# Altium schematic sheet top.SchDoc
size 420 x 297 mm; SheetNumber: 1; SheetTotal: 6
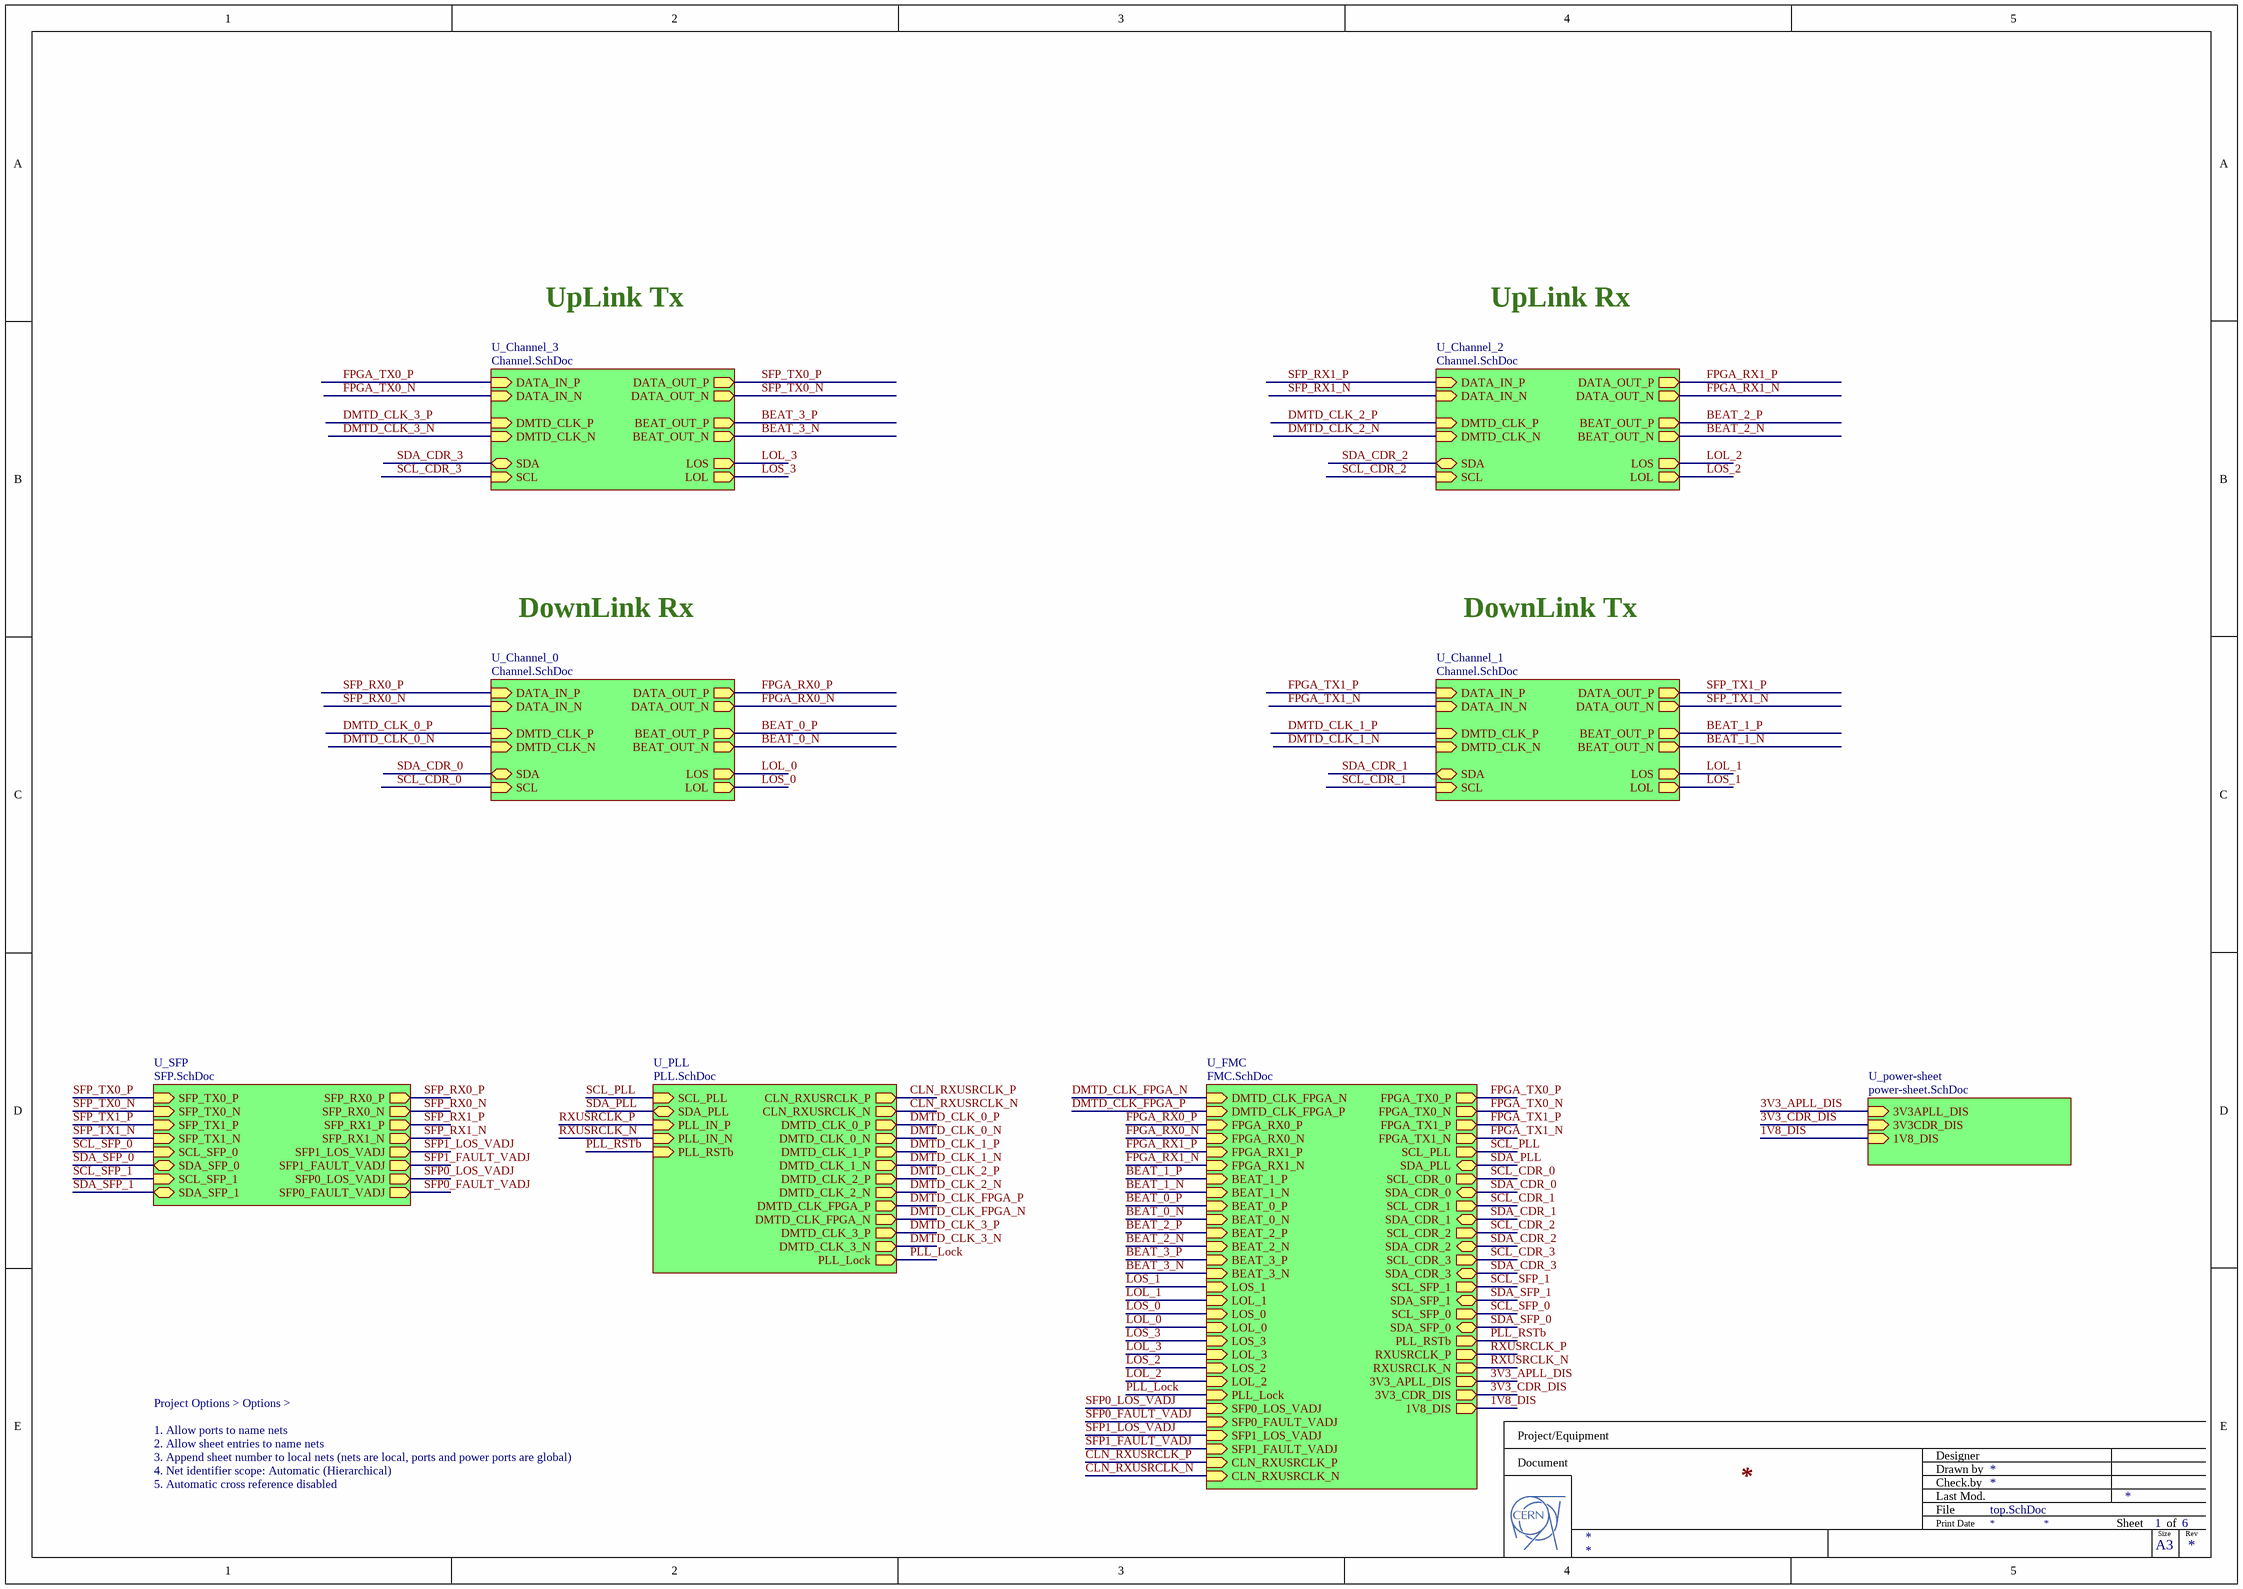
[diagram p0: top.SchDoc]

## Sub-sheets
U_Channel_0 = Channel.SchDoc: DATA_IN_P (in), DATA_IN_N (in), BEAT_OUT_P (out), BEAT_OUT_N (out), DMTD_CLK_P (in), DMTD_CLK_N (in), DATA_OUT_P (out), DATA_OUT_N (out), LOS (out), LOL (out), SDA (bidir), SCL (in)
U_Channel_1 = Channel.SchDoc: DATA_IN_P (in), DATA_IN_N (in), BEAT_OUT_P (out), BEAT_OUT_N (out), DMTD_CLK_P (in), DMTD_CLK_N (in), DATA_OUT_P (out), DATA_OUT_N (out), LOS (out), LOL (out), SDA (bidir), SCL (in)
U_Channel_2 = Channel.SchDoc: DATA_IN_P (in), DATA_IN_N (in), BEAT_OUT_P (out), BEAT_OUT_N (out), DMTD_CLK_P (in), DMTD_CLK_N (in), DATA_OUT_P (out), DATA_OUT_N (out), LOS (out), LOL (out), SDA (bidir), SCL (in)
U_Channel_3 = Channel.SchDoc: DATA_IN_P (in), DATA_IN_N (in), BEAT_OUT_P (out), BEAT_OUT_N (out), DMTD_CLK_P (in), DMTD_CLK_N (in), DATA_OUT_P (out), DATA_OUT_N (out), LOS (out), LOL (out), SDA (bidir), SCL (in)
U_FMC = FMC.SchDoc: DMTD_CLK_FPGA_N (in), DMTD_CLK_FPGA_P (in), FPGA_RX0_P (in), FPGA_RX0_N (in), FPGA_TX0_P (out), FPGA_TX0_N (out), FPGA_RX1_P (in), FPGA_RX1_N (in), FPGA_TX1_P (out), FPGA_TX1_N (out), BEAT_1_P (in), BEAT_1_N (in), BEAT_0_P (in), BEAT_0_N (in), BEAT_2_P (in), BEAT_2_N (in), BEAT_3_P (in), BEAT_3_N (in), SCL_PLL (out), SDA_PLL (bidir), SCL_CDR_0 (out), SDA_CDR_0 (bidir), SCL_CDR_1 (out), SDA_CDR_1 (bidir), SCL_CDR_2 (out), SDA_CDR_2 (bidir), SCL_CDR_3 (out), SDA_CDR_3 (bidir), SCL_SFP_1 (out), SDA_SFP_1 (bidir), SCL_SFP_0 (out), SDA_SFP_0 (bidir), LOS_1 (in), LOL_1 (in), LOS_0 (in), LOL_0 (in), LOS_3 (in), LOL_3 (in), LOS_2 (in), LOL_2 (in), PLL_Lock (in), SFP0_LOS_VADJ (in), SFP0_FAULT_VADJ (in), SFP1_LOS_VADJ (in), SFP1_FAULT_VADJ (in), PLL_RSTb (out), CLN_RXUSRCLK_P (in), CLN_RXUSRCLK_N (in), RXUSRCLK_P (out), RXUSRCLK_N (out), 3V3_APLL_DIS (out), 3V3_CDR_DIS (out), 1V8_DIS (out)
U_PLL = PLL.SchDoc: SCL_PLL (in), SDA_PLL (bidir), PLL_IN_P (in), PLL_IN_N (in), CLN_RXUSRCLK_P (out), CLN_RXUSRCLK_N (out), DMTD_CLK_0_P (out), DMTD_CLK_0_N (out), DMTD_CLK_1_P (out), DMTD_CLK_1_N (out), DMTD_CLK_2_P (out), DMTD_CLK_2_N (out), DMTD_CLK_FPGA_P (out), DMTD_CLK_FPGA_N (out), DMTD_CLK_3_P (out), DMTD_CLK_3_N (out), PLL_Lock (out), PLL_RSTb (in)
U_power-sheet = power-sheet.SchDoc: 3V3APLL_DIS (in), 3V3CDR_DIS (in), 1V8_DIS (in)
U_SFP = SFP.SchDoc: SFP_RX0_P (out), SFP_RX0_N (out), SFP_TX0_P (in), SFP_TX0_N (in), SFP_RX1_P (out), SFP_RX1_N (out), SFP_TX1_P (in), SFP_TX1_N (in), SCL_SFP_0 (in), SDA_SFP_0 (bidir), SCL_SFP_1 (in), SDA_SFP_1 (bidir), SFP1_LOS_VADJ (out), SFP1_FAULT_VADJ (out), SFP0_LOS_VADJ (out), SFP0_FAULT_VADJ (out)

## Nets
1V8_DIS: sheet U_power-sheet/1V8_DIS, sheet U_FMC/1V8_DIS
3V3_APLL_DIS: sheet U_power-sheet/3V3APLL_DIS, sheet U_FMC/3V3_APLL_DIS
3V3_CDR_DIS: sheet U_power-sheet/3V3CDR_DIS, sheet U_FMC/3V3_CDR_DIS
BEAT_0_N: sheet U_Channel_0/BEAT_OUT_N, sheet U_FMC/BEAT_0_N
BEAT_0_P: sheet U_Channel_0/BEAT_OUT_P, sheet U_FMC/BEAT_0_P
BEAT_1_N: sheet U_Channel_1/BEAT_OUT_N, sheet U_FMC/BEAT_1_N
BEAT_1_P: sheet U_Channel_1/BEAT_OUT_P, sheet U_FMC/BEAT_1_P
BEAT_2_N: sheet U_Channel_2/BEAT_OUT_N, sheet U_FMC/BEAT_2_N
BEAT_2_P: sheet U_Channel_2/BEAT_OUT_P, sheet U_FMC/BEAT_2_P
BEAT_3_N: sheet U_Channel_3/BEAT_OUT_N, sheet U_FMC/BEAT_3_N
BEAT_3_P: sheet U_Channel_3/BEAT_OUT_P, sheet U_FMC/BEAT_3_P
CLN_RXUSRCLK_N: sheet U_PLL/CLN_RXUSRCLK_N, sheet U_FMC/CLN_RXUSRCLK_N
CLN_RXUSRCLK_P: sheet U_PLL/CLN_RXUSRCLK_P, sheet U_FMC/CLN_RXUSRCLK_P
DMTD_CLK_0_N: sheet U_PLL/DMTD_CLK_0_N, sheet U_Channel_0/DMTD_CLK_N
DMTD_CLK_0_P: sheet U_PLL/DMTD_CLK_0_P, sheet U_Channel_0/DMTD_CLK_P
DMTD_CLK_1_N: sheet U_PLL/DMTD_CLK_1_N, sheet U_Channel_1/DMTD_CLK_N
DMTD_CLK_1_P: sheet U_PLL/DMTD_CLK_1_P, sheet U_Channel_1/DMTD_CLK_P
DMTD_CLK_2_N: sheet U_PLL/DMTD_CLK_2_N, sheet U_Channel_2/DMTD_CLK_N
DMTD_CLK_2_P: sheet U_PLL/DMTD_CLK_2_P, sheet U_Channel_2/DMTD_CLK_P
DMTD_CLK_3_N: sheet U_PLL/DMTD_CLK_3_N, sheet U_Channel_3/DMTD_CLK_N
DMTD_CLK_3_P: sheet U_PLL/DMTD_CLK_3_P, sheet U_Channel_3/DMTD_CLK_P
DMTD_CLK_FPGA_N: sheet U_PLL/DMTD_CLK_FPGA_N, sheet U_FMC/DMTD_CLK_FPGA_N
DMTD_CLK_FPGA_P: sheet U_PLL/DMTD_CLK_FPGA_P, sheet U_FMC/DMTD_CLK_FPGA_P
FPGA_RX0_N: sheet U_Channel_0/DATA_OUT_N, sheet U_FMC/FPGA_RX0_N
FPGA_RX0_P: sheet U_Channel_0/DATA_OUT_P, sheet U_FMC/FPGA_RX0_P
FPGA_RX1_N: sheet U_Channel_2/DATA_OUT_N, sheet U_FMC/FPGA_RX1_N
FPGA_RX1_P: sheet U_Channel_2/DATA_OUT_P, sheet U_FMC/FPGA_RX1_P
FPGA_TX0_N: sheet U_Channel_3/DATA_IN_N, sheet U_FMC/FPGA_TX0_N
FPGA_TX0_P: sheet U_Channel_3/DATA_IN_P, sheet U_FMC/FPGA_TX0_P
FPGA_TX1_N: sheet U_Channel_1/DATA_IN_N, sheet U_FMC/FPGA_TX1_N
FPGA_TX1_P: sheet U_Channel_1/DATA_IN_P, sheet U_FMC/FPGA_TX1_P
LOL_0: sheet U_Channel_0/LOS, sheet U_FMC/LOL_0
LOL_1: sheet U_Channel_1/LOS, sheet U_FMC/LOL_1
LOL_2: sheet U_Channel_2/LOS, sheet U_FMC/LOL_2
LOL_3: sheet U_Channel_3/LOS, sheet U_FMC/LOL_3
LOS_0: sheet U_Channel_0/LOL, sheet U_FMC/LOS_0
LOS_1: sheet U_Channel_1/LOL, sheet U_FMC/LOS_1
LOS_2: sheet U_Channel_2/LOL, sheet U_FMC/LOS_2
LOS_3: sheet U_Channel_3/LOL, sheet U_FMC/LOS_3
PLL_Lock: sheet U_PLL/PLL_Lock, sheet U_FMC/PLL_Lock
PLL_RSTb: sheet U_PLL/PLL_RSTb, sheet U_FMC/PLL_RSTb
RXUSRCLK_N: sheet U_PLL/PLL_IN_N, sheet U_FMC/RXUSRCLK_N
RXUSRCLK_P: sheet U_PLL/PLL_IN_P, sheet U_FMC/RXUSRCLK_P
SCL_CDR_0: sheet U_Channel_0/SCL, sheet U_FMC/SCL_CDR_0
SCL_CDR_1: sheet U_Channel_1/SCL, sheet U_FMC/SCL_CDR_1
SCL_CDR_2: sheet U_Channel_2/SCL, sheet U_FMC/SCL_CDR_2
SCL_CDR_3: sheet U_Channel_3/SCL, sheet U_FMC/SCL_CDR_3
SCL_PLL: sheet U_PLL/SCL_PLL, sheet U_FMC/SCL_PLL
SCL_SFP_0: sheet U_SFP/SCL_SFP_0, sheet U_FMC/SCL_SFP_0
SCL_SFP_1: sheet U_SFP/SCL_SFP_1, sheet U_FMC/SCL_SFP_1
SDA_CDR_0: sheet U_Channel_0/SDA, sheet U_FMC/SDA_CDR_0
SDA_CDR_1: sheet U_Channel_1/SDA, sheet U_FMC/SDA_CDR_1
SDA_CDR_2: sheet U_Channel_2/SDA, sheet U_FMC/SDA_CDR_2
SDA_CDR_3: sheet U_Channel_3/SDA, sheet U_FMC/SDA_CDR_3
SDA_PLL: sheet U_PLL/SDA_PLL, sheet U_FMC/SDA_PLL
SDA_SFP_0: sheet U_SFP/SDA_SFP_0, sheet U_FMC/SDA_SFP_0
SDA_SFP_1: sheet U_SFP/SDA_SFP_1, sheet U_FMC/SDA_SFP_1
SFP0_FAULT_VADJ: sheet U_SFP/SFP0_FAULT_VADJ, sheet U_FMC/SFP0_FAULT_VADJ
SFP0_LOS_VADJ: sheet U_SFP/SFP0_LOS_VADJ, sheet U_FMC/SFP0_LOS_VADJ
SFP1_FAULT_VADJ: sheet U_SFP/SFP1_FAULT_VADJ, sheet U_FMC/SFP1_FAULT_VADJ
SFP1_LOS_VADJ: sheet U_SFP/SFP1_LOS_VADJ, sheet U_FMC/SFP1_LOS_VADJ
SFP_RX0_N: sheet U_SFP/SFP_RX0_N, sheet U_Channel_0/DATA_IN_N
SFP_RX0_P: sheet U_SFP/SFP_RX0_P, sheet U_Channel_0/DATA_IN_P
SFP_RX1_N: sheet U_SFP/SFP_RX1_N, sheet U_Channel_2/DATA_IN_N
SFP_RX1_P: sheet U_SFP/SFP_RX1_P, sheet U_Channel_2/DATA_IN_P
SFP_TX0_N: sheet U_SFP/SFP_TX0_N, sheet U_Channel_3/DATA_OUT_N
SFP_TX0_P: sheet U_SFP/SFP_TX0_P, sheet U_Channel_3/DATA_OUT_P
SFP_TX1_N: sheet U_SFP/SFP_TX1_N, sheet U_Channel_1/DATA_OUT_N
SFP_TX1_P: sheet U_SFP/SFP_TX1_P, sheet U_Channel_1/DATA_OUT_P

## Notes on the sheet
- UpLink Tx
- UpLink Rx
- DownLink Rx
- DownLink Tx
- Project Options > Options >
  1. Allow ports to name nets
  2. Allow sheet entries to name nets
  3. Append sheet number to local nets (nets are local, ports and power ports are global)
  4. Net identifier scope: Automatic (Hierarchical)
  5. Automatic cross reference disabled
- Project/Equipment
- Document
- Designer
- Drawn by
- Check.by
- File
- Last Mod.
- Print Date
- Sheet
- Size
- A3
- of
- Rev